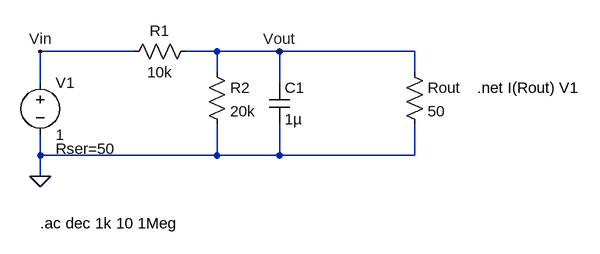
[diagram p0: schematic q4.asc]
q4.asc, the LTspice schematic file:
Version 4
SHEET 1 1140 680
WIRE 448 288 304 288
WIRE 576 288 528 288
WIRE 672 288 576 288
WIRE 880 288 672 288
WIRE 576 320 576 288
WIRE 880 320 880 288
WIRE 304 336 304 288
WIRE 672 336 672 288
WIRE 304 448 304 416
WIRE 576 448 576 400
WIRE 576 448 304 448
WIRE 672 448 672 400
WIRE 672 448 576 448
WIRE 880 448 880 400
WIRE 880 448 672 448
WIRE 304 480 304 448
FLAG 304 480 0
FLAG 304 288 Vin
FLAG 672 288 Vout
SYMBOL res 560 304 R0
SYMATTR InstName R2
SYMATTR Value 20k
SYMBOL voltage 304 320 R0
WINDOW 39 24 118 Left 2
SYMATTR SpiceLine Rser=50
SYMATTR InstName V1
SYMATTR Value 1
SYMATTR Value2 AC 1V
SYMBOL cap 656 336 R0
SYMATTR InstName C1
SYMATTR Value 1µ
SYMBOL Res 544 272 R90
WINDOW 0 0 56 VBottom 2
WINDOW 3 32 56 VTop 2
SYMATTR InstName R1
SYMATTR Value 10k
SYMBOL Res 864 304 R0
SYMATTR InstName Rout
SYMATTR Value 50
TEXT 304 552 Left 2 !.ac dec 1k 10 1Meg
TEXT 976 344 Left 2 !.net I(Rout) V1

The netlist it stands for:
* q4.asc
R2 Vout 0 20k
V1 Vin 0 1 AC 1V Rser=50
C1 Vout 0 1µ
R1 Vout Vin 10k
Rout Vout 0 50
.ac dec 1k 10 1Meg
.net I(Rout) V1
.backanno
.end